# Altium schematic sheet 1XGSH00_LCD.SchDoc
size A4
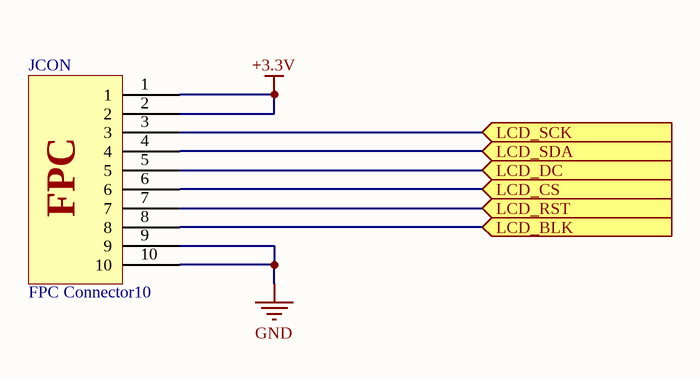
[diagram p0: 1XGSH00_LCD.SchDoc]

## Parts
JCON  FPC Connector10  [FPC-SMD_10P]

## Ports
LCD_BLK (in), LCD_CS (in), LCD_DC (in), LCD_RST (in), LCD_SCK (in), LCD_SDA (in)

## Nets
+3.3V: JCON.1 JCON.2
GND: JCON.9 JCON.10
LCD_BLK: JCON.8 ; port LCD_BLK
LCD_CS: JCON.6 ; port LCD_CS
LCD_DC: JCON.5 ; port LCD_DC
LCD_RST: JCON.7 ; port LCD_RST
LCD_SCK: JCON.3 ; port LCD_SCK
LCD_SDA: JCON.4 ; port LCD_SDA

## Notes on the sheet
- (in symbol FPC Connector10) FPC

## Library data of the parts
JCON = FPC Connector10: FPC 0.5mm 14P